# EAGLE design smd_circuit (EAGLE 5.11)
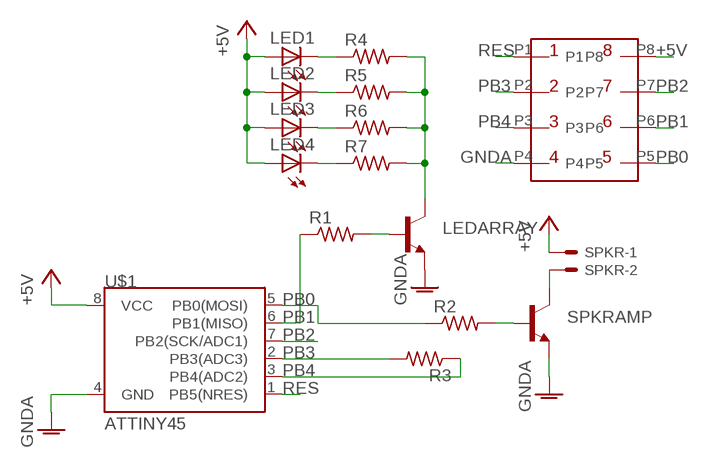
[diagram p0: schematic, sheet 1]

## Parts
LED1  LEDOPTEK-DURIS5  [OPTEK-DURIS5]
LED2  LEDOPTEK-DURIS5  [OPTEK-DURIS5]
LED3  LEDOPTEK-DURIS5  [OPTEK-DURIS5]
LED4  LEDOPTEK-DURIS5  [OPTEK-DURIS5]
LEDARRAY  SOT23-BEC  [SOT23-BEC]
R1  R-US_R0603  [R0603]
R2  R-US_R0603  [R0603]
R3  R-US_R0603  [R0603]
R4  R-US_R1210  [R1210]
R5  R-US_R1210  [R1210]
R6  R-US_R1210  [R1210]
R7  R-US_R1210  [R1210]
SPKR  KK-156-2  [KK-156-2]
SPKRAMP  SOT23-BEC  [SOT23-BEC]
U$1  ATTINY45  [SO08-EIAJ]
U$2  DIP8SMDDIP8SMD  [DIP8SMD]

## Nets
+5V: LED1.ANODE(A) LED2.ANODE(A) LED3.ANODE(A) LED4.ANODE(A) SPKR.1 U$1.8(VCC) U$2.P8
GNDA: LEDARRAY.E SPKRAMP.E U$1.4(GND) U$2.P4
N$1: SPKR.2 SPKRAMP.C
N$4: R2.2 SPKRAMP.B
N$5: LEDARRAY.C R4.2 R5.2 R6.2 R7.2
N$6: LEDARRAY.B R1.2
N$9: LED1.CATHODE(C) R4.1
N$10: LED2.CATHODE(C) R5.1
N$11: LED3.CATHODE(C) R6.1
N$12: LED4.CATHODE(C) R7.1
PB0: R2.1 U$1.5(PB0(MOSI)) U$2.P5
PB1: R1.1 U$1.6(PB1(MISO)) U$2.P6
PB2: U$1.7(PB2(SCK/ADC1)) U$2.P7
PB3: R3.2 U$1.2(PB3(ADC3)) U$2.P2
PB4: R3.1 U$1.3(PB4(ADC2)) U$2.P3
RES: U$1.1(PB5(NRES)) U$2.P1

## Library data of the parts
LED1-LED4 = smd_parts:LED: LED OSRAM: - CHIPLED LG R971, LG N971, LY N971, LG Q971, LY Q971, LO R971, LY R971 LH N974, LH R974 LS Q976, LO Q976, LY Q976 LO Q996 - Hyper CHIPLED LW Q18S LB Q993, LB Q99A, LB R99A - SideLED LS A670, LO A670, LY A670, LG A670, LP A670 LB A673, LV A673, LT A673, LW A673 LH A674 LY A675 LS A676, LA A676, LO A676, LY A676, LW A676 LS A679, LY A679, LG A679 - Hyper Micro SIDELED® LS Y876, LA Y876, LO Y876, LY Y876 LT Y87S - SmartLED LW L88C, LW L88S LB L89C, LB L89S, LG L890 LS L89K, LO L89K, LY L89K LS L896, LA L896, LO L896, LY L896 - TOPLED LS T670, LO T670, LY T670, LG T670, LP T670 LSG T670, LSP T670, LSY T670, LOP T670, LYG T670 LG T671, LOG T671, LSG T671 LB T673, LV T673, LT T673, LW T673 LH T674 LS T676, LA T676, LO T676, LY T676, LB T676, LH T676, LSB T676, LW T676 LB T67C, LV T67C, LT T67C, LS T67K, LO T67K, LY T67K, LW E67C LS E67B, LA E67B, LO E67B, LY E67B, LB E67C, LV E67C, LT E67C LW T67C LS T679, LY T679, LG T679 LS T770, LO T770, LY T770, LG T770, LP T770 LB T773, LV T773, LT T773, LW T773 LH T774 LS E675, LA E675, LY E675, LS T675 LS T776, LA T776, LO T776, LY T776, LB T776 LHGB T686 LT T68C, LB T68C - Hyper Mini TOPLED® LB M676 - Mini TOPLED Santana® LG M470 LS M47K, LO M47K, LY M47K Source: http://www.osram.convergy.de LUXEON: - LUMILED® LXK2-PW12-R00, LXK2-PW12-S00, LXK2-PW14-U00, LXK2-PW14-V00 LXK2-PM12-R00, LXK2-PM12-S00, LXK2-PM14-U00 LXK2-PE12-Q00, LXK2-PE12-R00, LXK2-PE12-S00, LXK2-PE14-T00, LXK2-PE14-U00 LXK2-PB12-K00, LXK2-PB12-L00, LXK2-PB12-M00, LXK2-PB14-N00, LXK2-PB14-P00, LXK2-PB14-Q00 LXK2-PR12-L00, LXK2-PR12-M00, LXK2-PR14-Q00, LXK2-PR14-R00 LXK2-PD12-Q00, LXK2-PD12-R00, LXK2-PD12-S00 LXK2-PH12-R00, LXK2-PH12-S00 LXK2-PL12-P00, LXK2-PL12-Q00, LXK2-PL12-R00 Source: www.luxeon.com KINGBRIGHT: KA-3528ASYC Source: www.kingbright.com
LEDARRAY SPKRAMP = smd_parts:SOT23-BEC
R1-R7 = rcl:R-US_: RESISTOR, American symbol
SPKR = con-molex:KK-156-2: KK 156 HEADER Source: http://www.molex.com/pdm_docs/sd/026604100_sd.pdf; OC_FARNELL: unknown; OC_NEWARK: unknown
U$1 = SparkFun:ATTINY45: Atmel ATTiny45
U$2 = smd_parts:DIP8SMD

## Board
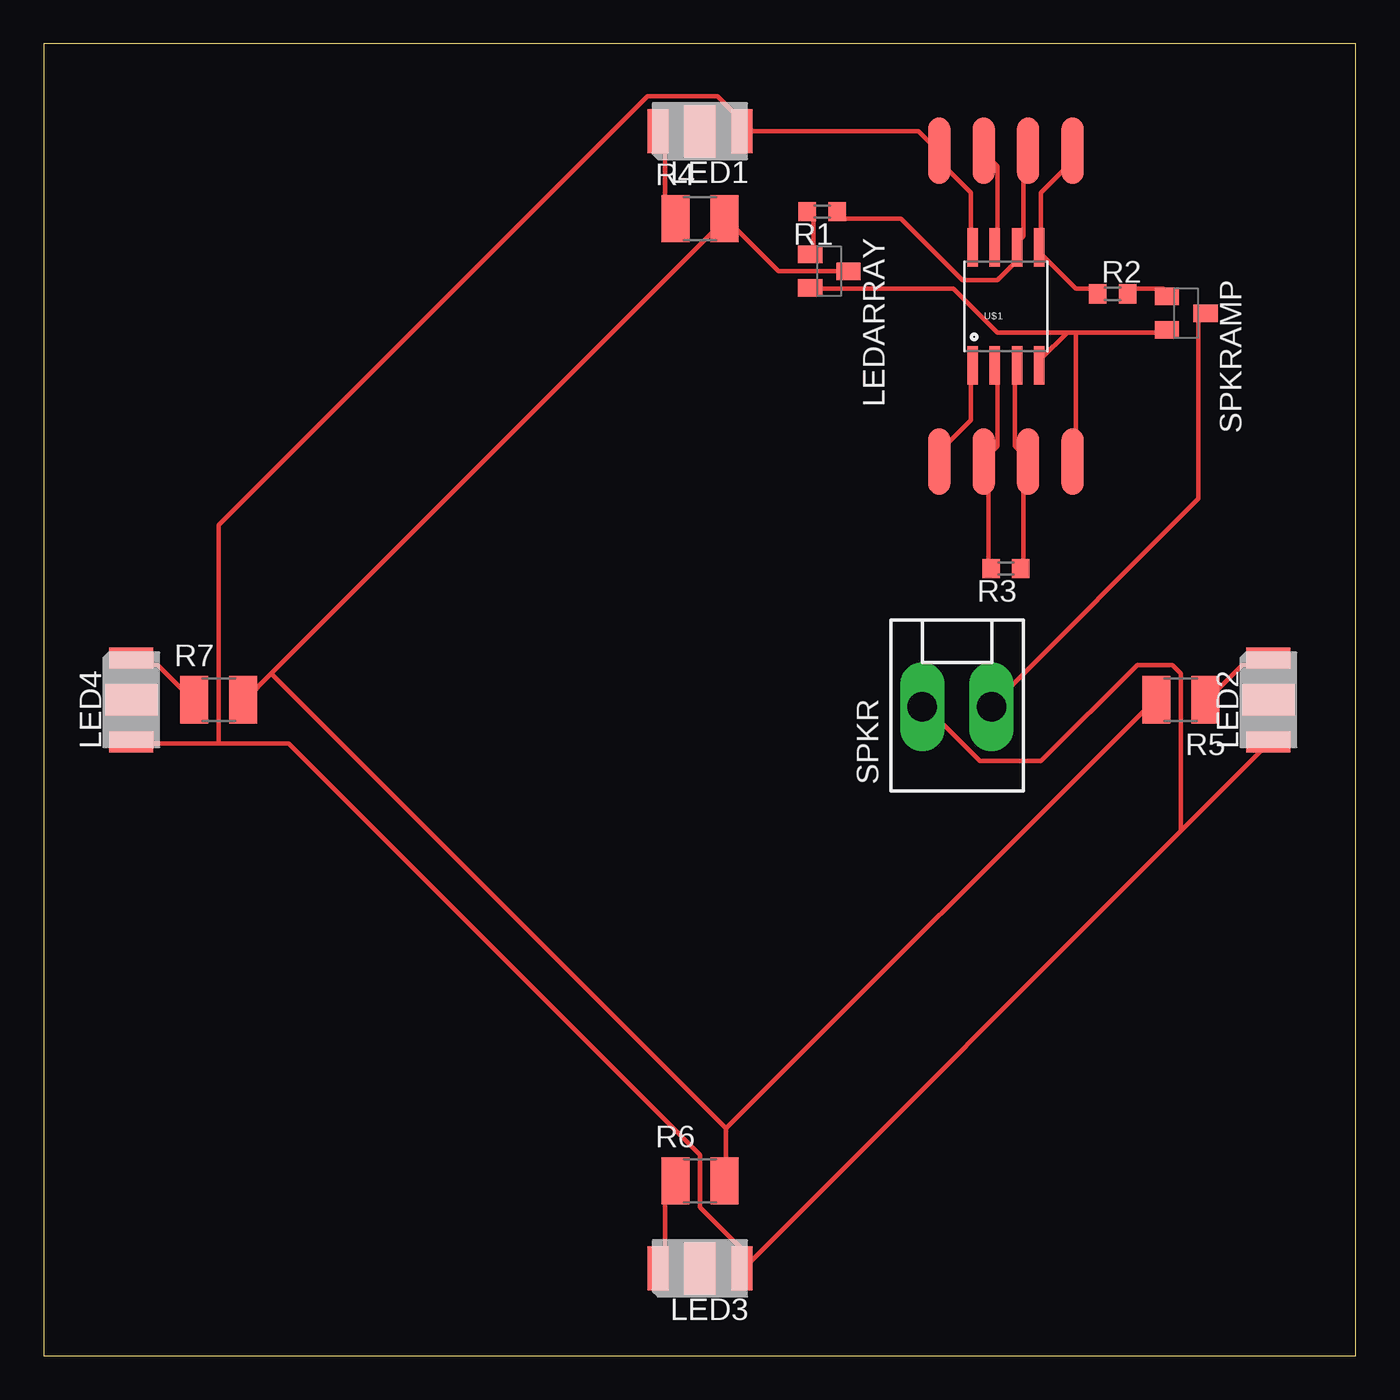
[diagram p1: board, top side]

Size 75 x 75 mm. Coordinates in mm from the lower left corner, seen from the top.
Outline: 0,0 75,0 75,75 0,75 0,0
Copper layers (1*16): Top 0.035mm / dielectric 1.5mm / Bottom 0.035mm
Design rules "default *": minimum track width 10mil, minimum drill 24mil, track to track 10mil, track to pad 10mil, pad to pad 10mil, via to via 10mil, smd to smd 10mil, copper to edge 40mil, drill to drill 8mil, minimum pad ring 10mil, minimum via ring 8mil, stop-mask expansion 4mil, vias tented up to drill 0mil, thermal gap 10mil

### Footprints (pad centres in the part's own frame; a part is rotated, then mirrored left to right if it is on the bottom)
OPTEK-DURIS5 = smd 2.5 x 1.2: ANODE 0,-2.4; CATHODE 0,2.4 | smd 3 x 1.8: P$5 0,0
SOT23-BEC = smd 1 x 1.4: B -0.95,-1.1; C 0,1.1; E 0.95,-1.1
R0603 = smd 1 x 1.1: 1 -0.85,0; 2 0.85,0
R1210 = smd 1.6 x 2.7: 1 -1.4,0; 2 1.4,0
KK-156-2 = drill 1.7 pad 2.184 long: 1 -1.98,0; 2 1.98,0
SO08-EIAJ = smd 0.61 x 2.21: 1 -1.905,-3.378; 2 -0.635,-3.378; 3 0.635,-3.378; 4 1.905,-3.378; 5 1.905,3.353; 6 0.635,3.353; 7 -0.635,3.353; 8 -1.905,3.353
DIP8SMD = smd 3.81 x 1.27: P1 -8.89,3.81; P2 -8.89,1.27; P3 -8.89,-1.27; P4 -8.89,-3.81; P5 8.89,-3.81; P6 8.89,-1.27; P7 8.89,1.27; P8 8.89,3.81

### Placement (x,y rotation side)
LED1  37.5,70 90 top
LED2  70,37.5 0 top
LED3  37.5,5 90 top
LED4  5,37.5 0 top
LEDARRAY  44.9,62 270 top
R1  44.5,65.4 180 top
R2  61.1,60.7 0 top
R3  55,45 180 top
R4  37.5,65 0 top
R5  65,37.5 180 top
R6  37.5,10 0 top
R7  10,37.5 0 top
SPKR  52.2,37.1 0 top
SPKRAMP  65.3,59.6 270 top
U$1  55,60 0 top
U$2  55,60 90 top

### Tracks (layer width: path | path; a pad name or v marks a point on that pad's centre or on a via)
+5V
  Top 0.254: U$1.8 53,63.5 53,66.5 51,68.5 U$2.P8 51,69 50,70 LED1.ANODE 39.5,70 39.5,71 38.5,72 34.5,72 10,47.5 10,35 | 65,30 70,35 LED2.ANODE | 40.5,5.5 65,30 | 40.5,5.5 40,5 LED3.ANODE | 10,35 14,35 37.5,11.5 37.5,8.5 40.5,5.5 | 10,35 5,35 LED4.ANODE | 65,30 65,39 64.5,39.5 62.5,39.5 57,34 53.5,34 50.5,37 SPKR.1
GNDA
  Top 0.254: 58.5,58.5 59,58.5 | 59,58.5 64,58.5 SPKRAMP.E | 58.5,58.5 57,57 U$1.4 | 58.5,58.5 54.5,58.5 52,61 44,61 LEDARRAY.E | 59,58.5 59,51.5 U$2.P4
N$1
  Top 0.254: SPKRAMP.C 66,59.5 66,49 54.5,37.5 SPKR.2
N$4
  Top 0.254: R2.2 62,61 64,61 SPKRAMP.B
N$5
  Top 0.254: 39,13 39,10 R6.2 | 39,13 63.5,37.5 R5.2 | LEDARRAY.C 42,62 39,65 | 13,39 39,65 | 13,39 11.5,37.5 R7.2 | 39,65 R4.2 | 13,39 39,13
N$6
  Top 0.254: R1.2 44,65 44,63 LEDARRAY.B
N$9
  Top 0.254: LED1.CATHODE 35.5,70 35.5,65.5 36,65 R4.1
N$10
  Top 0.254: LED2.CATHODE 70,39.5 68.5,39.5 66.5,37.5 R5.1
N$11
  Top 0.254: LED3.CATHODE 35.5,5 35.5,9.5 36,10 R6.1
N$12
  Top 0.254: LED4.CATHODE 5,39.5 6.5,39.5 8.5,37.5 R7.1
PB0
  Top 0.254: R2.1 60,61 59,61 57,63 U$1.5 57,63.5 57,66.5 59,68.5 U$2.P5
PB1
  Top 0.254: R1.1 45.5,65 49,65 52.5,61.5 54.5,61.5 55.5,62.5 55.5,63 U$1.6 55.5,63.5 56,64 56,68.5 U$2.P6
PB2
  Top 0.254: U$1.7 54.5,63.5 54.5,68 54,68.5 U$2.P7
PB3
  Top 0.254: R3.2 54,45 54,51 U$2.P2 54,51.5 54.5,52 54.5,56.5 U$1.2
PB4
  Top 0.254: R3.1 56,45 56,51 U$2.P3 56,51.5 55.5,52 55.5,56.5 U$1.3
RES
  Top 0.254: U$1.1 53,56.5 53,53.5 51,51.5 U$2.P1